# Altium schematic sheet Simple-Six-SATA-Backplane-Top.SchDoc
size C; SheetNumber: 1; SheetTotal: 1
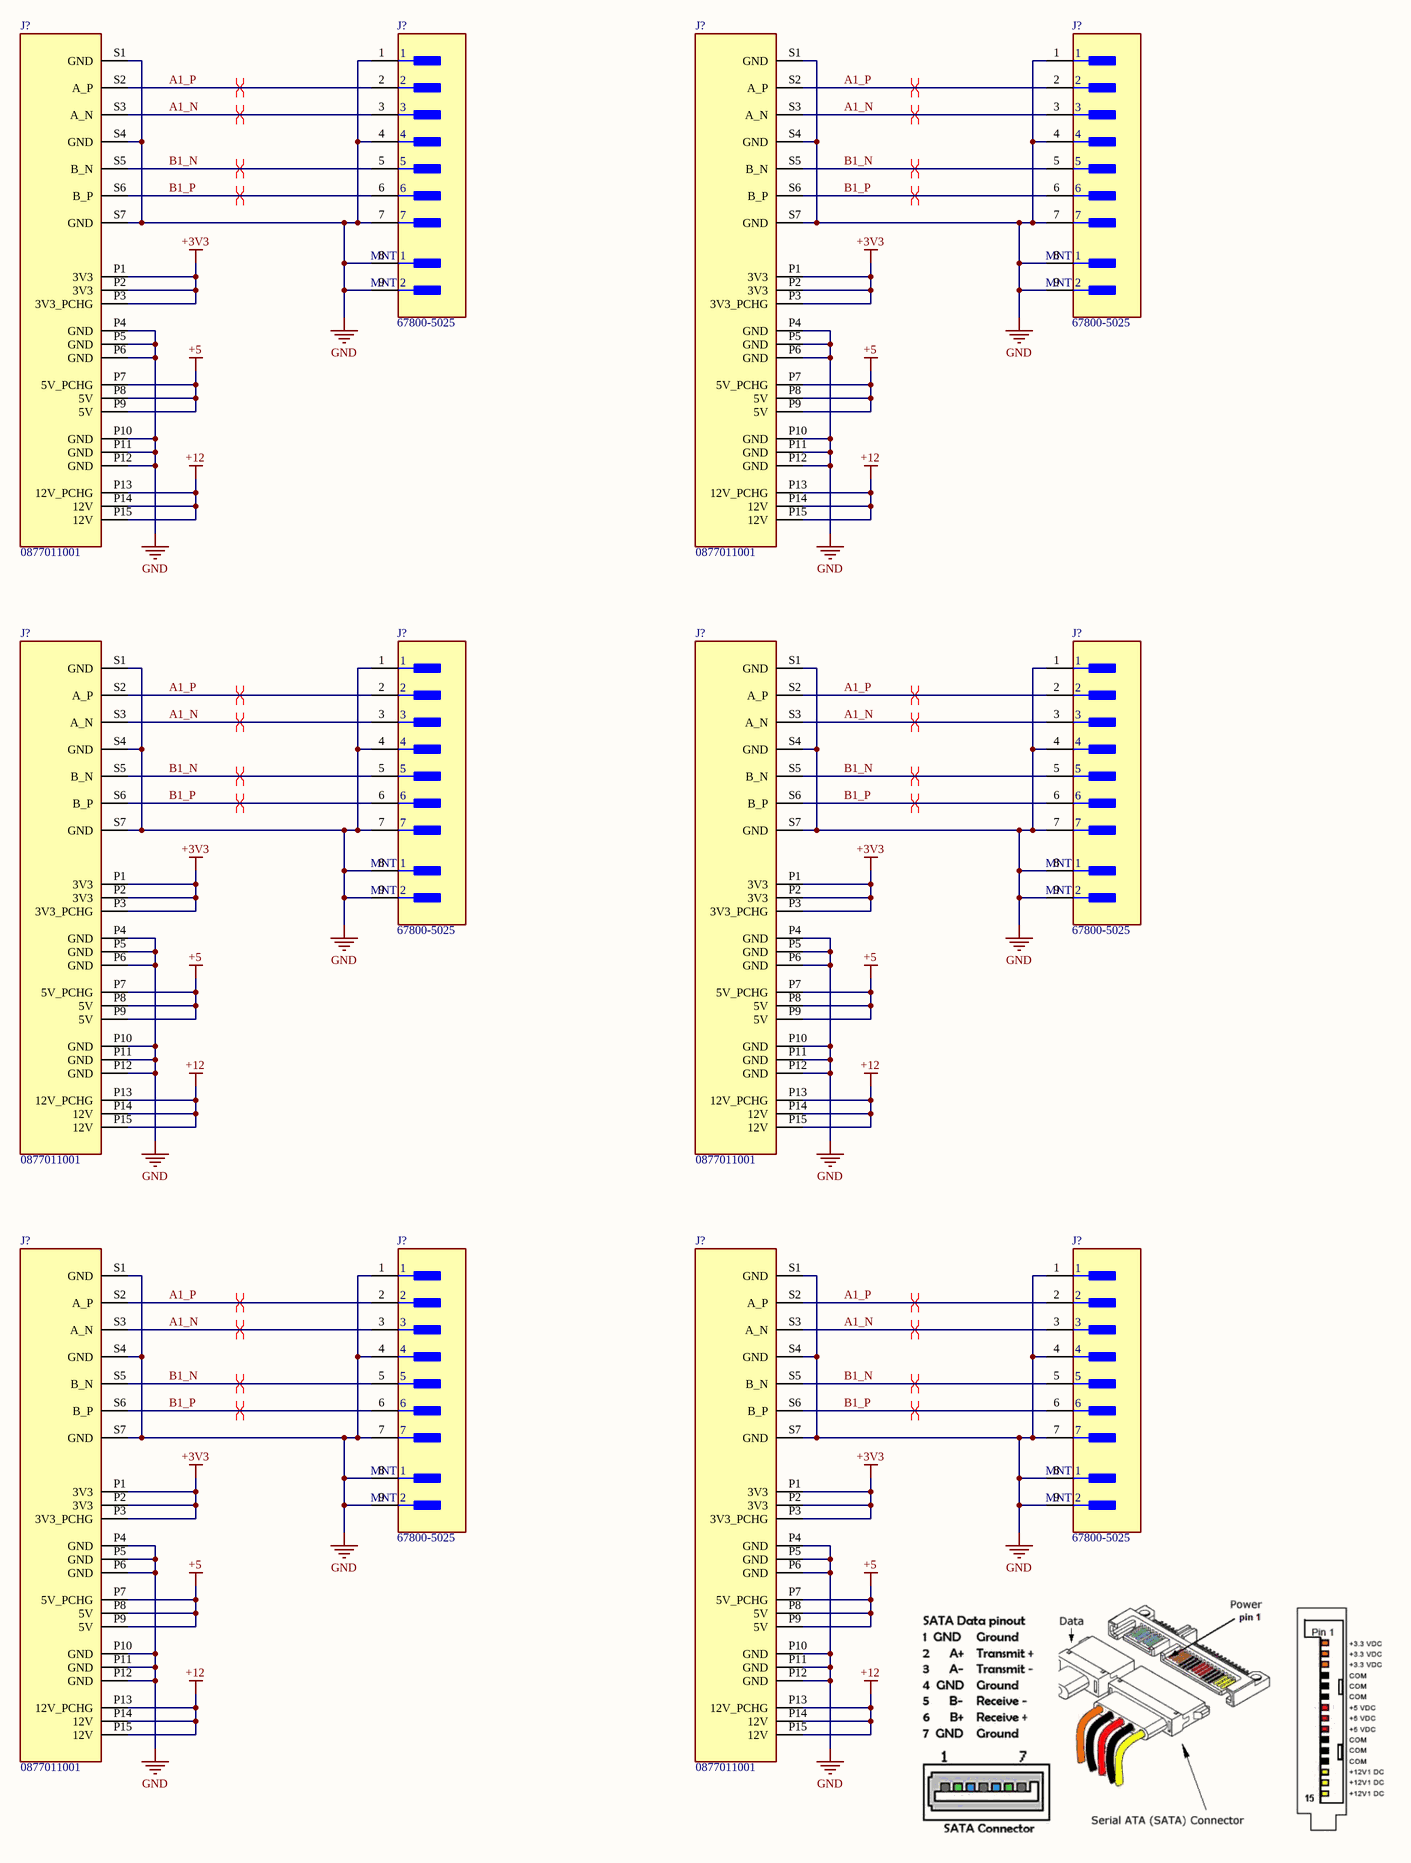
[diagram p0: Simple-Six-SATA-Backplane-Top.SchDoc]

## Parts
(Parts that share a designator on the sheet are numbered #1, #2 ... from top to bottom, then left to right.)
J?#1  0877011001  [0877011001]
J?#2  67800-5025  [FP-67800-5025-MFG]
J?#3  0877011001  [0877011001]
J?#4  67800-5025  [FP-67800-5025-MFG]
J?#5  0877011001  [0877011001]
J?#6  67800-5025  [FP-67800-5025-MFG]
J?#7  0877011001  [0877011001]
J?#8  67800-5025  [FP-67800-5025-MFG]
J?#9  0877011001  [0877011001]
J?#10  67800-5025  [FP-67800-5025-MFG]
J?#11  0877011001  [0877011001]
J?#12  67800-5025  [FP-67800-5025-MFG]

## Nets
+3V3: J?#1.P1(3V3) J?#1.P2(3V3) J?#1.P3(3V3_PCHG) J?#3.P1(3V3) J?#3.P2(3V3) J?#3.P3(3V3_PCHG) J?#5.P1(3V3) J?#5.P2(3V3) J?#5.P3(3V3_PCHG) J?#7.P1(3V3) J?#7.P2(3V3) J?#7.P3(3V3_PCHG) J?#9.P1(3V3) J?#9.P2(3V3) J?#9.P3(3V3_PCHG) J?#11.P1(3V3) J?#11.P2(3V3) J?#11.P3(3V3_PCHG)
+5: J?#1.P7(5V_PCHG) J?#1.P8(5V) J?#1.P9(5V) J?#3.P7(5V_PCHG) J?#3.P8(5V) J?#3.P9(5V) J?#5.P7(5V_PCHG) J?#5.P8(5V) J?#5.P9(5V) J?#7.P7(5V_PCHG) J?#7.P8(5V) J?#7.P9(5V) J?#9.P7(5V_PCHG) J?#9.P8(5V) J?#9.P9(5V) J?#11.P7(5V_PCHG) J?#11.P8(5V) J?#11.P9(5V)
+12: J?#1.P13(12V_PCHG) J?#1.P14(12V) J?#1.P15(12V) J?#3.P13(12V_PCHG) J?#3.P14(12V) J?#3.P15(12V) J?#5.P13(12V_PCHG) J?#5.P14(12V) J?#5.P15(12V) J?#7.P13(12V_PCHG) J?#7.P14(12V) J?#7.P15(12V) J?#9.P13(12V_PCHG) J?#9.P14(12V) J?#9.P15(12V) J?#11.P13(12V_PCHG) J?#11.P14(12V) J?#11.P15(12V)
GND: J?#1.P4(GND) J?#1.P5(GND) J?#1.P6(GND) J?#1.P10(GND) J?#1.P11(GND) J?#1.P12(GND) J?#1.S1(GND) J?#1.S4(GND) J?#1.S7(GND) J?#2.1 J?#2.4 J?#2.7 J?#2.8(MNT_1) J?#2.9(MNT_2) J?#3.P4(GND) J?#3.P5(GND) J?#3.P6(GND) J?#3.P10(GND) J?#3.P11(GND) J?#3.P12(GND) J?#3.S1(GND) J?#3.S4(GND) J?#3.S7(GND) J?#4.1 J?#4.4 J?#4.7 J?#4.8(MNT_1) J?#4.9(MNT_2) J?#5.P4(GND) J?#5.P5(GND) J?#5.P6(GND) J?#5.P10(GND) J?#5.P11(GND) J?#5.P12(GND) J?#5.S1(GND) J?#5.S4(GND) J?#5.S7(GND) J?#6.1 J?#6.4 J?#6.7 J?#6.8(MNT_1) J?#6.9(MNT_2) J?#7.P4(GND) J?#7.P5(GND) J?#7.P6(GND) J?#7.P10(GND) J?#7.P11(GND) J?#7.P12(GND) J?#7.S1(GND) J?#7.S4(GND) J?#7.S7(GND) J?#8.1 J?#8.4 J?#8.7 J?#8.8(MNT_1) J?#8.9(MNT_2) J?#9.P4(GND) J?#9.P5(GND) J?#9.P6(GND) J?#9.P10(GND) J?#9.P11(GND) J?#9.P12(GND) J?#9.S1(GND) J?#9.S4(GND) J?#9.S7(GND) J?#10.1 J?#10.4 J?#10.7 J?#10.8(MNT_1) J?#10.9(MNT_2) J?#11.P4(GND) J?#11.P5(GND) J?#11.P6(GND) J?#11.P10(GND) J?#11.P11(GND) J?#11.P12(GND) J?#11.S1(GND) J?#11.S4(GND) J?#11.S7(GND) J?#12.1 J?#12.4 J?#12.7 J?#12.8(MNT_1) J?#12.9(MNT_2)
A1_N: J?#1.S3(A_N) J?#2.3 J?#3.S3(A_N) J?#4.3 J?#5.S3(A_N) J?#6.3 J?#7.S3(A_N) J?#8.3 J?#9.S3(A_N) J?#10.3 J?#11.S3(A_N) J?#12.3
A1_P: J?#1.S2(A_P) J?#2.2 J?#3.S2(A_P) J?#4.2 J?#5.S2(A_P) J?#6.2 J?#7.S2(A_P) J?#8.2 J?#9.S2(A_P) J?#10.2 J?#11.S2(A_P) J?#12.2
B1_N: J?#1.S5(B_N) J?#2.5 J?#3.S5(B_N) J?#4.5 J?#5.S5(B_N) J?#6.5 J?#7.S5(B_N) J?#8.5 J?#9.S5(B_N) J?#10.5 J?#11.S5(B_N) J?#12.5
B1_P: J?#1.S6(B_P) J?#2.6 J?#3.S6(B_P) J?#4.6 J?#5.S6(B_P) J?#6.6 J?#7.S6(B_P) J?#8.6 J?#9.S6(B_P) J?#10.6 J?#11.S6(B_P) J?#12.6

## Layout directives
differential pair: A1_N, A1_P, B1_N, B1_P

## Library data of the parts
J?#1 J?#3 J?#5 J?#7 J?#9 J?#11 = 0877011001: Connector; Manufacturer_Name: Molex; Description: I/O Connectors SATA COMBO HOST REC VT PFIT; Datasheet Link: https://www.molex.com/pdm_docs/sd/877011001_sd.pdf; Height: 8.25mm; Manufacturer_Part_Number: 0877011001; Mouser Part Number: N/A; Mouser Price/Stock: https://www.mouser.co.uk/ProductDetail/Molex/0877011001?qs=PBcRNPEHKsqwD0qCdO56GA%3D%3D; Arrow Part Number: 0877011001; Arrow Price/Stock: https://www.arrow.com/en/products/0877011001/molex
J?#2 J?#4 J?#6 J?#8 J?#10 J?#12 = CMP-04776-000822-1: CONN SATA HEADER 7POS SLD SMD; Number of Positions: 7; Pitch: 1.27mm; Voltage Rating (DC): 15V; Glow Wire Compliant: Non-compliant; Gender: Male; Current Rating: 1.5A; Packaging: Tray; Orientation: Straight; Termination: SMD/SMT; Contact Plating: Gold; Contact Material: Brass; Connector Type: SATA; Series: 67800; Mount: Surface Mount; Flammability Rating: UL94 V-0; Housing Material: Thermoplastic; Max Operating Temperature: 85°C; Color: Black; Radiation Hardening: No; Voltage Rating: 15V; Min Operating Temperature: -35°C; Package Quantity: 4800; Max Voltage Rating (AC): 15V; Number of Contacts: 7; Number of Rows: 1; Number of Circuits: 7